# EAGLE design ADP5063 (EAGLE 6.4)
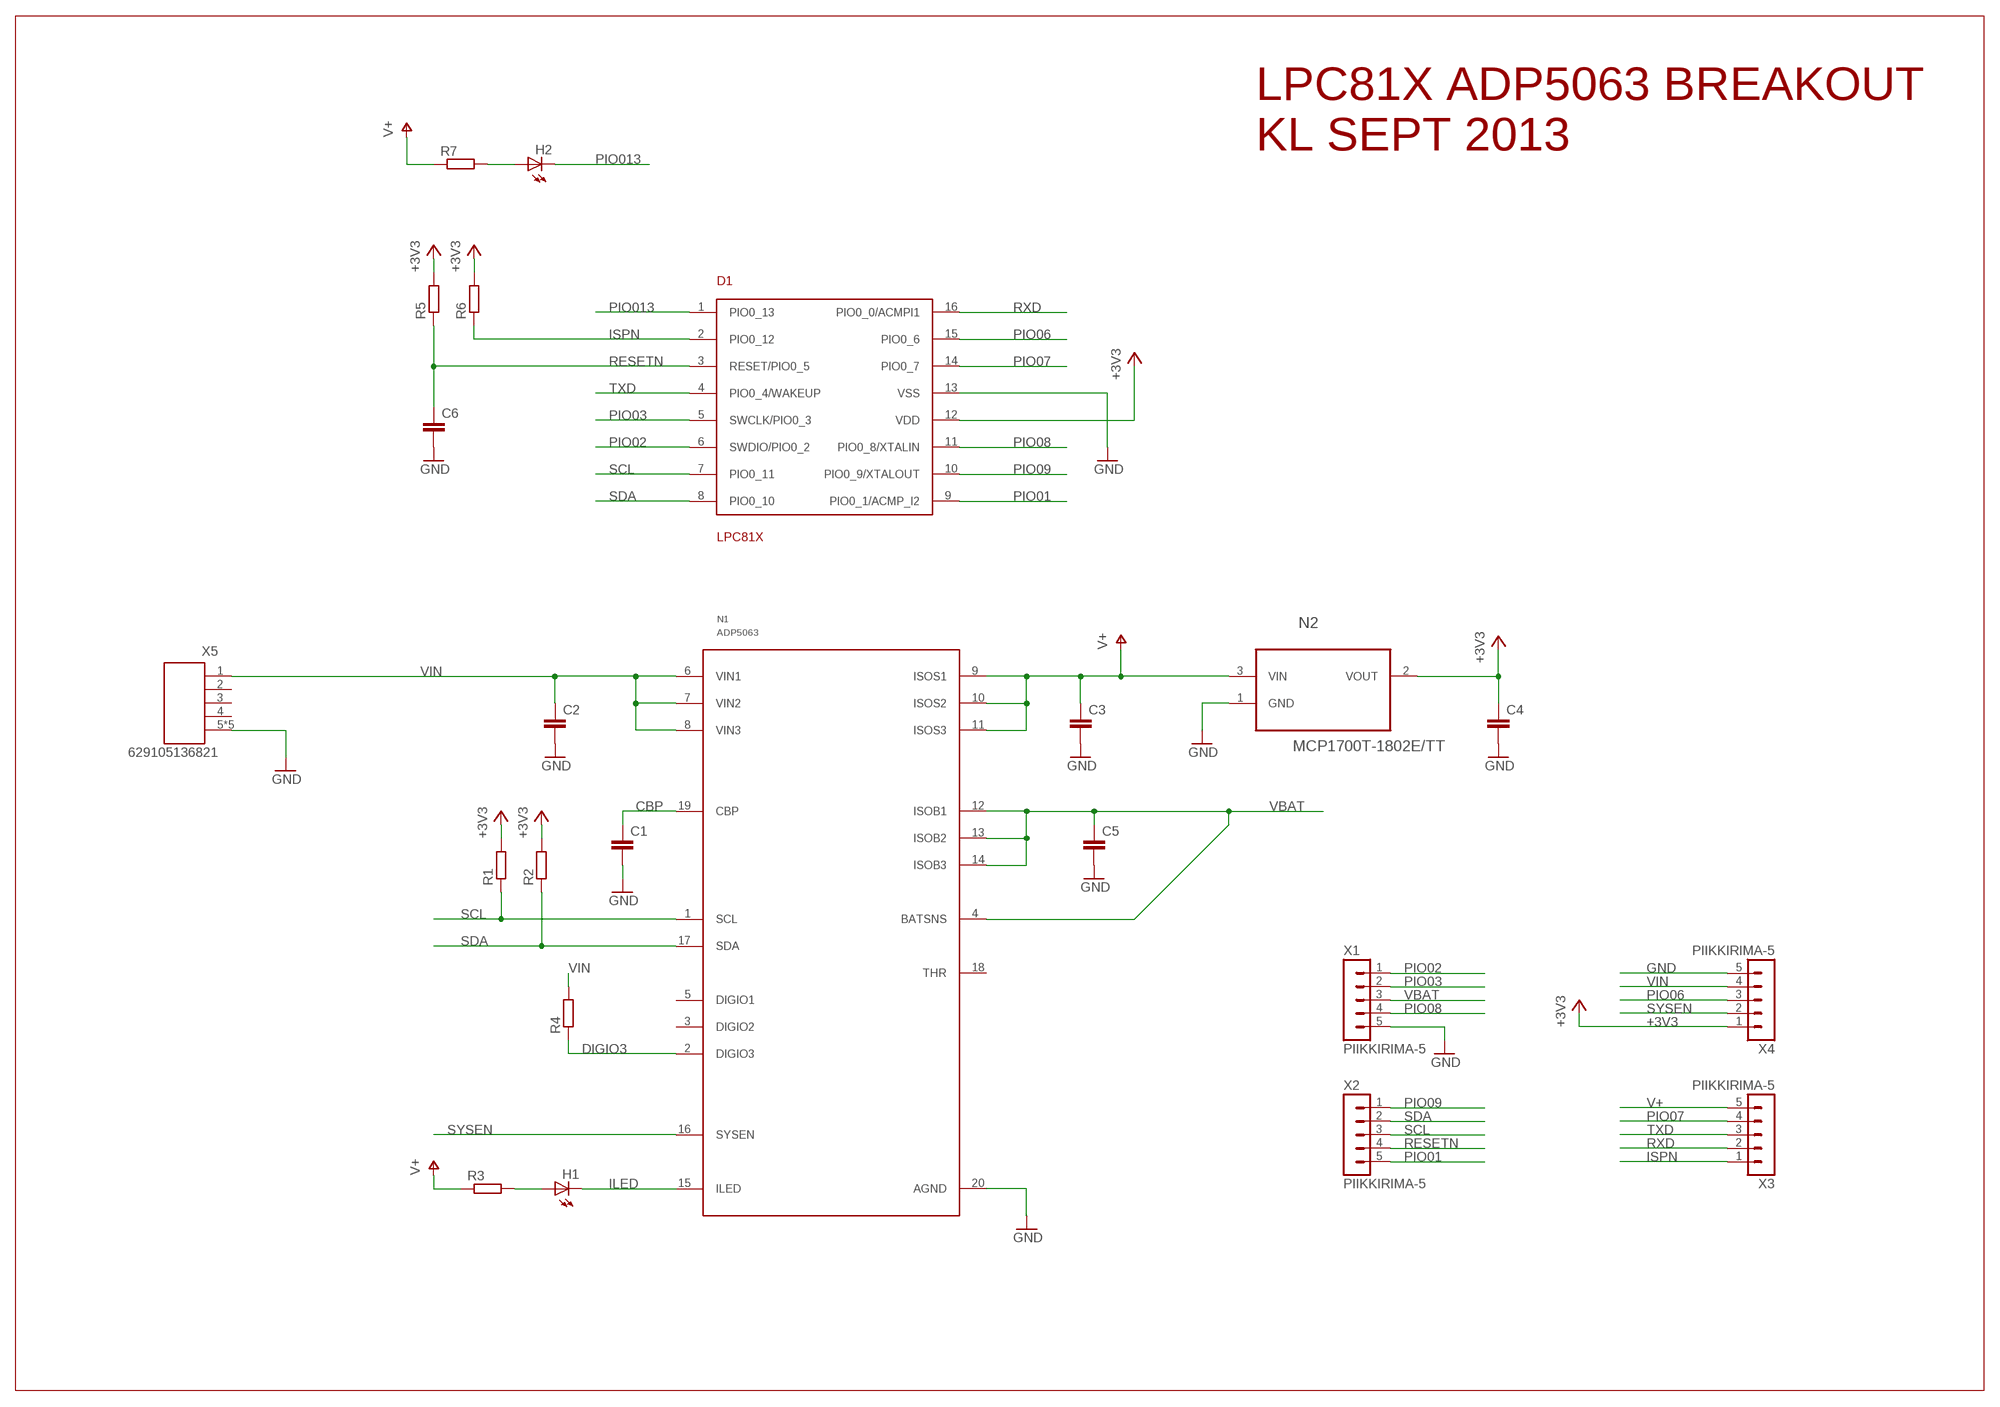
[diagram p0: schematic, sheet 1]

## Parts
C1  C-EUC0603  [C0603]
C2  C-EUC1206  [C1206]
C3  C-EUC1206  [C1206]
C4  C-EUC1206  [C1206]
C5  C-EUC1206  [C1206]
C6  C-EUC0603  [C0603]
D1  LPC81X  [TSSOP16]
H1  LEDCHIP-LED0603  [CHIP-LED0603]
H2  LEDCHIP-LED0603  [CHIP-LED0603]
N1  ADP5063  [QFN50P400X400X80-21N]
N2  MCP1700T-1802E/TT  [SOT95P237X112-3N]
R1  R-EU_R0603  [R0603]
R2  R-EU_R0603  [R0603]
R3  R-EU_R0603  [R0603]
R4  R-EU_R0603  [R0603]
R5  R-EU_R0603  [R0603]
R6  R-EU_R0603  [R0603]
R7  R-EU_R0603  [R0603]
X1  PIIKKIRIMA-5  [PIIKKIRIMA-5]
X2  PIIKKIRIMA-5  [PIIKKIRIMA-5]
X3  PIIKKIRIMA-5  [PIIKKIRIMA-5]
X4  PIIKKIRIMA-5  [PIIKKIRIMA-5]
X5  629105136821  [629105136821]

## Nets
+3V3: C4.1 D1.12(VDD) N2.2(VOUT) R1.2 R2.2 R5.2 R6.2 X4.1
CBP: C1.1 N1.19(CBP)
DIGIO3: N1.2(DIGIO3) R4.1
GND: C1.2 C2.2 C3.2 C4.2 C5.2 C6.2 D1.13(VSS) N1.20(AGND) N2.1(GND) X1.5 X4.5 X5.5 X5.Z1 X5.Z2 X5.Z3 X5.Z4
ILED: H1.C N1.15(ILED)
ISPN: D1.2(PIO0_12) R6.1 X3.1
N$1: H1.A R3.2
N$5: H2.A R7.2
PIO01: D1.9(PIO0_1/ACMP_I2) X2.5
PIO02: D1.6(SWDIO/PIO0_2) X1.1
PIO03: D1.5(SWCLK/PIO0_3) X1.2
PIO06: D1.15(PIO0_6) X4.3
PIO07: D1.14(PIO0_7) X3.4
PIO08: D1.11(PIO0_8/XTALIN) X1.4
PIO09: D1.10(PIO0_9/XTALOUT) X2.1
PIO013: D1.1(PIO0_13) H2.C
RESETN: C6.1 D1.3(RESET/PIO0_5) R5.1 X2.4
RXD: D1.16(PIO0_0/ACMPI1) X3.2
SCL: D1.7(PIO0_11) N1.1(SCL) R1.1 X2.3
SDA: D1.8(PIO0_10) N1.17(SDA) R2.1 X2.2
SYSEN: N1.16(SYSEN) X4.2
TXD: D1.4(PIO0_4/WAKEUP) X3.3
V+: C3.1 N1.9(ISOS1) N1.10(ISOS2) N1.11(ISOS3) N2.3(VIN) R3.1 R7.1 X3.5
VBAT: C5.1 N1.4(BATSNS) N1.12(ISOB1) N1.13(ISOB2) N1.14(ISOB3) X1.3
VIN: C2.1 N1.6(VIN1) N1.7(VIN2) N1.8(VIN3) R4.2 X4.4 X5.1
Unconnected: N1.3(DIGIO2) N1.5(DIGIO1) N1.18(THR) X5.2 X5.3 X5.4

## Notes on the sheet
- LPC81X ADP5063 BREAKOUT
  KL SEPT 2013

## Library data of the parts
C1-C6 = rcl:C-EU: CAPACITOR, European symbol
D1 = seb:LPC81X
H1 H2 = OMAT_IC:LED: LED OSRAM: - CHIPLED LG R971, LG N971, LY N971, LG Q971, LY Q971, LO R971, LY R971 LH N974, LH R974 LS Q976, LO Q976, LY Q976 LO Q996 - Hyper CHIPLED LW Q18S LB Q993, LB Q99A, LB R99A - SideLED LS A670, LO A670, LY A670, LG A670, LP A670 LB A673, LV A673, LT A673, LW A673 LH A674 LY A675 LS A676, LA A676, LO A676, LY A676, LW A676 LS A679, LY A679, LG A679 - Hyper Micro SIDELED® LS Y876, LA Y876, LO Y876, LY Y876 LT Y87S - SmartLED LW L88C, LW L88S LB L89C, LB L89S, LG L890 LS L89K, LO L89K, LY L89K LS L896, LA L896, LO L896, LY L896 - TOPLED LS T670, LO T670, LY T670, LG T670, LP T670 LSG T670, LSP T670, LSY T670, LOP T670, LYG T670 LG T671, LOG T671, LSG T671 LB T673, LV T673, LT T673, LW T673 LH T674 LS T676, LA T676, LO T676, LY T676, LB T676, LH T676, LSB T676, LW T676 LB T67C, LV T67C, LT T67C, LS T67K, LO T67K, LY T67K, LW E67C LS E67B, LA E67B, LO E67B, LY E67B, LB E67C, LV E67C, LT E67C LW T67C LS T679, LY T679, LG T679 LS T770, LO T770, LY T770, LG T770, LP T770 LB T773, LV T773, LT T773, LW T773 LH T774 LS E675, LA E675, LY E675, LS T675 LS T776, LA T776, LO T776, LY T776, LB T776 LHGB T686 LT T68C, LB T68C - Hyper Mini TOPLED® LB M676 - Mini TOPLED Santana® LG M470 LS M47K, LO M47K, LY M47K Source: http://www.osram.convergy.de LUXEON: - LUMILED® LXK2-PW12-R00, LXK2-PW12-S00, LXK2-PW14-U00, LXK2-PW14-V00 LXK2-PM12-R00, LXK2-PM12-S00, LXK2-PM14-U00 LXK2-PE12-Q00, LXK2-PE12-R00, LXK2-PE12-S00, LXK2-PE14-T00, LXK2-PE14-U00 LXK2-PB12-K00, LXK2-PB12-L00, LXK2-PB12-M00, LXK2-PB14-N00, LXK2-PB14-P00, LXK2-PB14-Q00 LXK2-PR12-L00, LXK2-PR12-M00, LXK2-PR14-Q00, LXK2-PR14-R00 LXK2-PD12-Q00, LXK2-PD12-R00, LXK2-PD12-S00 LXK2-PH12-R00, LXK2-PH12-S00 LXK2-PL12-P00, LXK2-PL12-Q00, LXK2-PL12-R00 Source: www.luxeon.com KINGBRIGHT: KA-3528ASYC Source: www.kingbright.com
N1 = OMAT_IC:ADP5063
N2 = Microchip_By_element14_Batch_1:MCP1700T-1802E/TT: Low Quiescent Current LDO; MPN: MCP1700T-1802E/TT; OC_FARNELL: 1296591; OC_NEWARK: 84R5175; PACKAGE: SOT23-3; SUPPLIER: Microchip
R1-R7 = rcl:R-EU_: RESISTOR, European symbol
X1-X4 = OMAT_IC:PIIKKIRIMA-5
X5 = OMAT_IC:629105136821: WR-COM SMT Horizontal 5 Contacts Micro USB Type B,5 pins

## Board
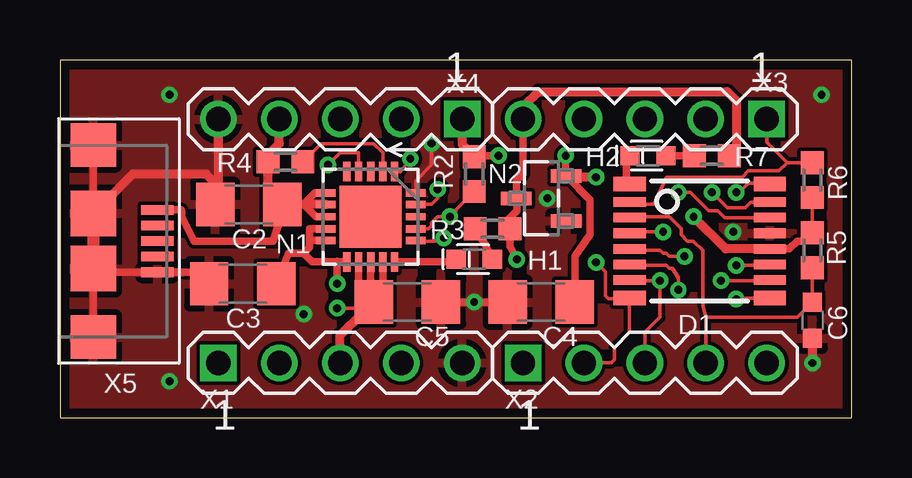
[diagram p1: board, top side]
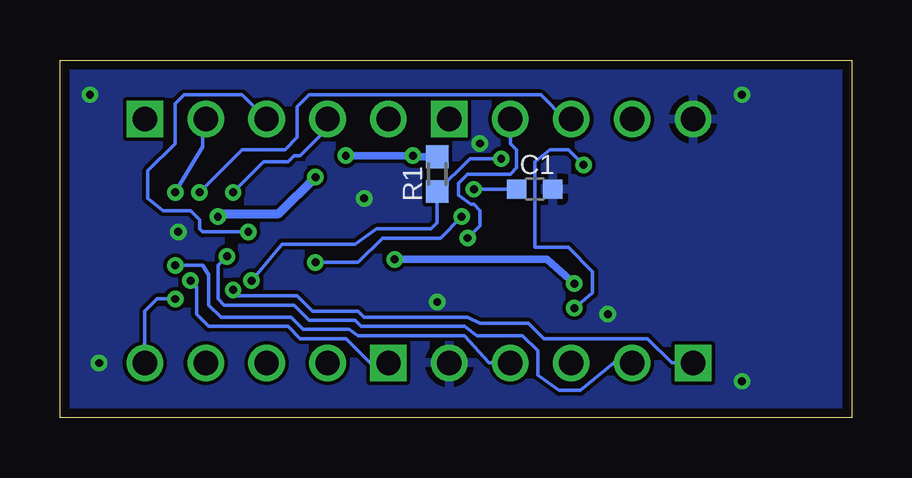
[diagram p2: board, bottom side, seen from below]

Size 33 x 14.91 mm. Coordinates in mm from the lower left corner, seen from the top.
Outline: 0,0 33,0 33,14.91 0,14.91 0,0
Copper layers (1*16): Top 0.0356mm / dielectric 1.5011mm / Bottom 0.0356mm
Design rules "LaenPCBOrder": minimum track width 6mil, minimum drill 13mil, track to track 6mil, track to pad 6mil, pad to pad 6mil, via to via 6mil, smd to smd 6mil, copper to edge 15mil, drill to drill 6mil, minimum pad ring 7mil, minimum via ring 7mil, stop-mask expansion 4mil, vias tented up to drill 0mil, thermal gap 10mil

### Footprints (pad centres in the part's own frame; a part is rotated, then mirrored left to right if it is on the bottom)
C0603 = smd 0.8 x 0.8: 1 -0.75,0; 2 0.75,0
C1206 = smd 1.6 x 1.8: 1 -1.4,0; 2 1.4,0
TSSOP16 = smd 0.6 x 1.35: 1 -2.375,-2.925; 8 2.375,-2.925; 9 2.375,2.925; 16 -2.375,2.925 | smd 0.4 x 1.35: 2 -1.625,-2.925; 3 -0.975,-2.925; 4 -0.325,-2.925; 5 0.325,-2.925; 6 0.975,-2.925; 7 1.625,-2.925; 10 1.625,2.925; 11 0.975,2.925; 12 0.325,2.925; 13 -0.325,2.925; 14 -0.975,2.925; 15 -1.625,2.925
CHIP-LED0603 = smd 0.8 x 0.8: A -0.75,0; C 0.75,0
QFN50P400X400X80-21N = smd 0.813 x 0.305: 1 -1.88,0.991; 2 -1.88,0.508; 3 -1.88,0; 4 -1.88,-0.508; 5 -1.88,-0.991; 11 1.88,-0.991; 12 1.88,-0.508; 13 1.88,0; 14 1.88,0.508; 15 1.88,0.991 | smd 0.305 x 0.813: 6 -0.991,-1.88; 7 -0.508,-1.88; 8 0,-1.88; 9 0.508,-1.88; 10 0.991,-1.88; 16 0.991,1.88; 17 0.508,1.88; 18 0,1.88; 19 -0.508,1.88; 20 -0.991,1.88 | smd 2.591 x 2.591: 21 0,0
SOT95P237X112-3N = smd 0.559 x 1.27: 1 -0.94,-1.041; 2 0.94,-1.041; 3 0,1.041
R0603 = smd 0.95 x 0.95: 1 -0.725,0; 2 0.725,0
PIIKKIRIMA-5 = drill 1.016 square: 1 0,0 | drill 1.016: 2 2.54,0; 3 5.08,0; 4 7.62,0; 5 10.16,0
629105136821 = smd 0.4 x 1.35: 1 -1.3,0; 2 -0.65,0; 3 0,0; 4 0.65,0; 5 1.3,0 | smd 1.8 x 1.9: Z1 -4,-2.675; Z4 4,-2.675 | smd 1.9 x 1.9: Z2 -1.15,-2.675; Z3 1.15,-2.675

### Placement (x,y rotation side)
C1  13.21,9.53 0 bottom
C2  7.87,8.89 180 top
C3  7.62,5.59 180 top
C4  20.07,4.83 180 top
C5  14.48,4.83 0 top
C6  31.37,4.06 270 top
D1  26.67,7.37 270 top
H1  17.27,6.6 180 top
H2  24.51,10.92 180 top
N1  12.95,8.38 270 top
N2  20.07,9.14 90 top
R1  17.27,10.16 90 bottom
R2  17.27,10.16 90 top
R3  18.03,7.87 180 top
R4  9.4,10.67 180 top
R5  31.37,6.98 90 top
R6  31.37,9.91 270 top
R7  27.18,10.92 180 top
U$1  [DAFUG-.SM]  6.6,7.37 90 bottom
X1  6.6,2.29 0 top
X2  19.3,2.29 0 top
X3  29.46,12.45 180 top
X4  16.76,12.45 180 top
X5  4.06,7.37 270 top

### Tracks (layer width: path | path; a pad name or v marks a point on that pad's centre or on a via)
+3V3  (via drill 0.33)
  Top 0.152: R6.2 R5.2
  Top 0.305: C4.1 21.47,6.73 22.1,7.62 22.1,9.09 N2.2 21.08,10.11 v21.08,10.92 | v18.29,10.92 17.31,10.92 R1.2 | D1.12 30.41,7.04 30.73,7.37 31.02,7.37 R5.2
  Top 0.381: X4.1 16.76,11.39 R1.2 | v22.35,10.03 21.16,10.03 N2.2 | D1.12 27.76,7.04 v26.42,8.38
  Bottom 0.305: R1.2 18.25,10.88 v18.29,10.92 v21.08,10.92
  Bottom 0.381: v26.42,8.38 26.29,8.51 23.88,8.51 v22.35,10.03
CBP  (via drill 0.33)
  Top 0.152: v15.75,9.53 15.75,9.14 15.49,8.89 N1.19
  Bottom 0.152: C1.1 v15.75,9.53
DIGIO3
  Top 0.152: 10.41,10.96 R4.1 10.88,11.43 13.08,11.43 13.46,11.05 N1.2
GND  (via drill 0.33)
  Top 0.152: N1.20 14.83,9.88 15.49,10.54 v15.49,11.43
  Top 0.305: X5.Z1 X5.Z2 | X5.Z4 X5.Z3 1.54,6.07 X5.5 5.94,6.07 C3.2 | N2.1 21.11,8.15 21.08,8.13 | C5.2 v17.27,4.83 C4.2
  Top 0.381: X5.Z2 3.03,10.16 6.1,10.16 6.47,9.78 C2.2 6.6,9.02 X4.5 | C6.2 v31.37,2.29
  Top 0.508: X5.Z2 X5.Z3
  other vias: 20.32,9.14 10.16,4.32 4.57,1.52 4.57,13.46 31.75,13.46 28.07,7.75
  pour Top: 0,14.99 33.27,14.99 33.27,0 0,0
  pour Bottom: 0,14.99 33.27,14.99 33.27,0 0,0
ILED
  Top 0.305: N1.15 16.17,6.5 H1.C
ISPN
  Top 0.152: R6.1 30.32,10.63 | 30.32,10.63 29.97,10.29 28.7,10.29 28.45,10.03 25.27,10.03 24.77,8.89 23.85,8.89 D1.2 | X3.1 29.46,11.48 30.32,10.63
N$1
  Top 0.305: H1.A 17.77,7.16 R3.2
N$5
  Top 0.305: R7.2 H2.A
PIO01  (via drill 0.33)
  Top 0.152: D1.9 28.23,4.99 v28.19,4.95
  Bottom 0.152: v28.19,4.95 28.96,4.95 29.46,4.45 X2.5
PIO02  (via drill 0.33)
  Top 0.152: v25.78,5.33 25.78,5.84 25.53,6.22 25.4,6.22 25.27,6.35 23.79,6.35 D1.6
  Bottom 0.152: X1.1 7.49,2.29 8.51,3.3 12.83,3.3 13.46,3.94 15.49,3.94 16,4.19 20.32,4.19 20.57,4.45 22.48,4.45 23.11,5.08 25.65,5.08 v25.78,5.33
PIO03  (via drill 0.33)
  Top 0.152: v26.03,6.73 25.4,6.73 25.27,6.86 25.15,6.86 25.02,6.98 23.8,6.98 D1.5
  Bottom 0.152: X1.2 9.91,2.29 11.3,1.14 12.19,1.14 13.08,1.78 13.08,2.79 13.72,3.43 15.62,3.43 16.13,3.81 20.45,3.81 20.7,4.06 22.61,4.06 23.24,4.7 26.16,4.7 26.42,4.95 26.42,6.35 v26.03,6.73
PIO06  (via drill 0.33)
  Top 0.152: D1.15 28.8,8.99 28.58,8.76 27.81,8.76 v27.18,9.4
  Bottom 0.152: X4.3 11.94,12.45 12.95,13.46 22.61,13.46 23.11,12.95 23.11,11.68 23.62,11.18 25.4,11.18 v27.18,9.4
PIO07  (via drill 0.33)
  Top 0.152: D1.14 27.73,8.34 27.43,8.64 27.05,8.64 26.29,9.4 v25.78,9.4
  Bottom 0.152: X3.4 21.84,12.07 22.99,10.92 23.24,10.92 23.49,10.67 24.51,10.67 v25.78,9.4
PIO08  (via drill 0.33)
  Top 0.152: v28.19,6.35 29.55,6.35 D1.11
  Bottom 0.152: X1.4 15.11,2.29 16.13,3.43 20.57,3.43 20.95,3.68 22.86,3.68 23.37,4.19 26.29,4.19 26.8,4.7 26.8,5.97 27.05,6.35 v28.19,6.35
PIO09  (via drill 0.33)
  Top 0.152: v27.56,5.71 29.57,5.71 D1.10
  Bottom 0.152: X2.1 20.07,2.29 21.08,3.3 22.99,3.3 23.49,3.81 26.8,3.81 27.3,4.32 27.3,5.46 v27.56,5.71
PIO013
  Top 0.305: H2.C 23.88,10.92 23.62,10.67 23.62,9.86 D1.1
RESETN
  Top 0.152: R5.1 C6.1 30.75,4.19 26.92,4.19 | 26.92,4.19 26.8,4.7 26.8,6.98 26.42,7.37 26.16,7.37 25.91,7.62 25.91,7.87 25.4,8.38 23.79,8.38 D1.3 | X2.4 26.92,4.19
RXD  (via drill 0.33)
  Top 0.152: v28.19,9.4 28.32,9.4 28.7,9.78 29.56,9.78 D1.16
  Bottom 0.152: X3.2 27.05,12.45 27.05,11.3 v28.19,9.4
SCL  (via drill 0.33)
  Top 0.152: N1.1 14.2,10.26 v14.61,10.79 | D1.7 23.77,5.71 v25.02,5.71 25.02,4.19 24.38,3.56 X2.3
  Bottom 0.152: v14.61,10.79 15.91,10.79 R1.1 17.27,8.13 17.53,7.87 19.81,7.87 20.7,7.24 23.75,7.24 v25.02,5.71
SDA  (via drill 0.33)
  Top 0.152: 15.24,7.87 N1.17 15.37,7.87 15.49,8 15.49,8.13 15.75,8.38 v16.26,8.38 16.51,8.64 16.51,8.67 R2.1 | X2.2 22.99,2.29 23.11,2.41 23.11,2.92 23.75,3.56 D1.8 23.71,4.95 22.86,4.95 22.73,5.08 22.73,6.1 v22.35,6.48
  Bottom 0.152: v16.26,8.38 17.15,7.49 19.56,7.49 20.57,6.48 v22.35,6.48
SYSEN  (via drill 0.33)
  Top 0.152: N1.16 14.76,7.39 14.73,7.37 15.62,7.37 v16,7.49
  Bottom 0.152: X4.2 14.22,11.43 13.97,11.18 13.97,10.41 14.22,10.16 16,10.16 16.38,9.78 16.38,9.27 15.87,8.89 15.75,8.89 15.49,8.64 15.49,8 v16,7.49
TXD  (via drill 0.33)
  Top 0.152: v25.15,7.75 23.8,7.75 D1.4
  Bottom 0.152: v25.15,7.75 27.05,7.75 27.18,7.87 27.18,8.26 27.56,8.64 28.7,8.64 29.34,9.14 29.34,10.29 28.19,11.43 28.19,13.08 27.81,13.46 25.4,13.46 X3.3
V+  (via drill 0.33)
  Top 0.305: N1.9 10.41,7.87 10.41,7.37 | 10.41,7.37 10.41,7.11 10.16,6.86 | 10.16,6.86 9.53,6.86 C3.1 | N1.11 10.52,6.5 | 10.52,6.5 10.16,6.86 | N1.10 10.44,7.39 10.41,7.37 | X3.5 19.3,10.16 19.02,9.88 N2.3 19.05,9.12 19.05,8.64 18.51,8.09 R3.1 18.76,7.15 v19.05,6.6 | v11.56,5.59 11.56,6.53 10.52,6.5
  Top 0.381: X3.5 19.3,12.95 19.94,13.59 27.81,13.59 28.19,13.21 28.19,11.21 R7.1
  Bottom 0.305: v19.05,6.6 12.7,6.6 v11.56,5.59
VBAT  (via drill 0.33)
  Top 0.152: N1.4 12.45,11.05 11.68,11.05 v11.18,10.54 | v11.56,4.57 12.45,4.57 12.63,4.38
  Top 0.305: N1.13 12.95,4.95 C5.1 | N1.12 12.45,5.46 C5.1 | N1.14 13.46,5.21 C5.1
  Top 0.381: X1.3 11.68,3.43 12.63,4.38 C5.1
  Bottom 0.152: v11.56,4.57 10.79,5.21 10.79,6.1 11.81,7.11 13.21,7.11 13.21,10.67 12.57,11.18 11.81,11.18 v11.18,10.54
VIN
  Top 0.152: 8.67,9.49 C2.1
  Top 0.305: N1.6 10.64,9.37 10.16,8.89 10.67,8.38 N1.8 | X5.1 5.05,8.67 5.08,8.64 5.08,8.38 5.59,7.37 8.89,7.37 9.14,8.13 9.14,8.51 9.53,8.89
  Top 0.381: N1.7 10.16,8.89 9.53,8.89 C2.1 | X4.4 9.14,11.43 8.67,10.96 R4.2 8.67,9.49

### Text on the board
bStop: KL2013